# EasyEDA schematic SCH_smart switch_2021-09-12.json
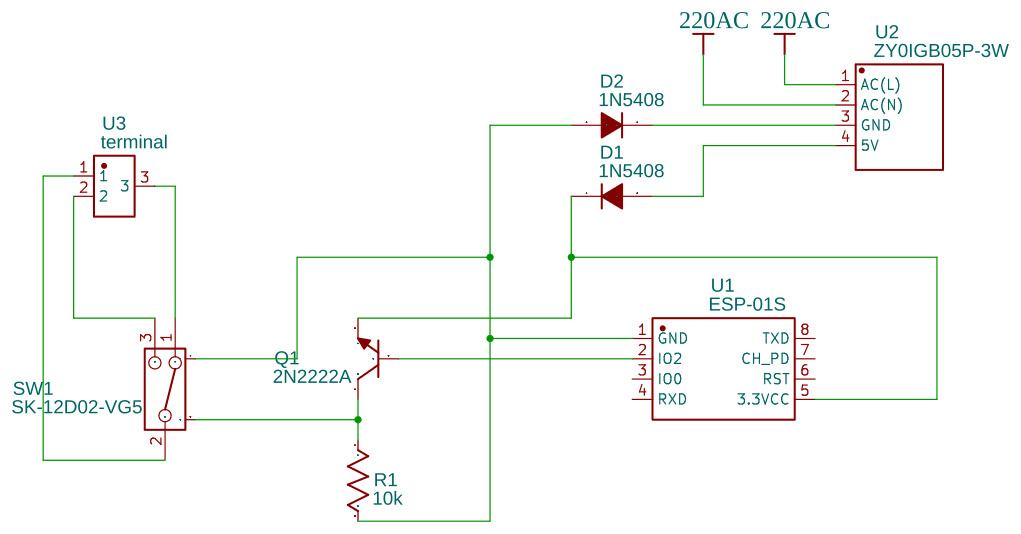
[diagram p0: schematic sheet]

## Parts
D1  1N5408  [DO-201AD_BD5.3-L8.4-P12.50-D1.4-RD]
D2  1N5408  [DO-201AD_BD5.3-L8.4-P12.50-D1.4-RD]
Q1  2N2222A  [TO-92-3_L4.8-W3.7-P2.54-R]
R1  10k  [R0603]
SW1  SK-12D02-VG5  [SW-TH_SK-12D02VG3]
U1  ESP-01S  [WIFIM-TH_ESP-01S]
U2  ZY0IGB05P-3W  [PWRM-TH_4P-L36.5-W18.9]
U3  terminal  [CONN-TH_2.54-3P]

## Library data of the parts
D1 D2 = 1N5408: Supplier: LCSC; Manufacturer: STARSEA; Supplier Part: C87459; JLCPCB Part Class: Extended Part
Q1 = 2N2222A: Supplier: LCSC; Supplier Part: C358533; Manufacturer: Foshan Blue Rocket Elec; Contributor: LCSC; JLCPCB Part Class: Extended Part
R1 = R_0603_US: Contributor: LCEDA_Lib
SW1 = SK-12D02-VG5: Supplier: LCSC; Supplier Part: C136722; Manufacturer: Rectangular Connectors - Contacts; Contributor: LCSC
U1 = ESP-01S: Supplier: LCSC; Manufacturer: Ai-Thinker; Supplier Part: C111009
U2 = ZY0IGB05P-3W: Supplier: LCSC; Manufacturer: ZLG; Supplier Part: C85698; JLCPCB Part Class: Extended Part
U3 = 2.54-3P接线端子: Supplier: LCSC; Supplier Part: C68305; Manufacturer: BOOMELE(博穆精密); JLCPCB Part Class: Extended Part; Contributor: LCSC

## Nets
220AC: U2.1(AC(L)) U2.2(AC(N))
Net-(D1-1): D1.1(K) Q1.3(E) U1.5(3.3VCC)
Net-(D1-2): D1.2(A) U2.4(5V)
Net-(D2-1): D2.1(K) U2.3(GND)
Net-(D2-2): D2.2(A) R1.2 SW1.4 U1.1(GND)
Net-(Q1-1): Q1.1(C) R1.1 SW1.5
Net-(Q1-2): Q1.2(B) U1.2(IO2)
Net-(SW1-1): SW1.1 U3.3
Net-(SW1-2): SW1.2 U3.1
Net-(SW1-3): SW1.3 U3.2

Not connected (* = marked no-connect by the designer): U1 3(IO0) 4(RXD) 6(RST) 7(CH_PD) 8(TXD)
